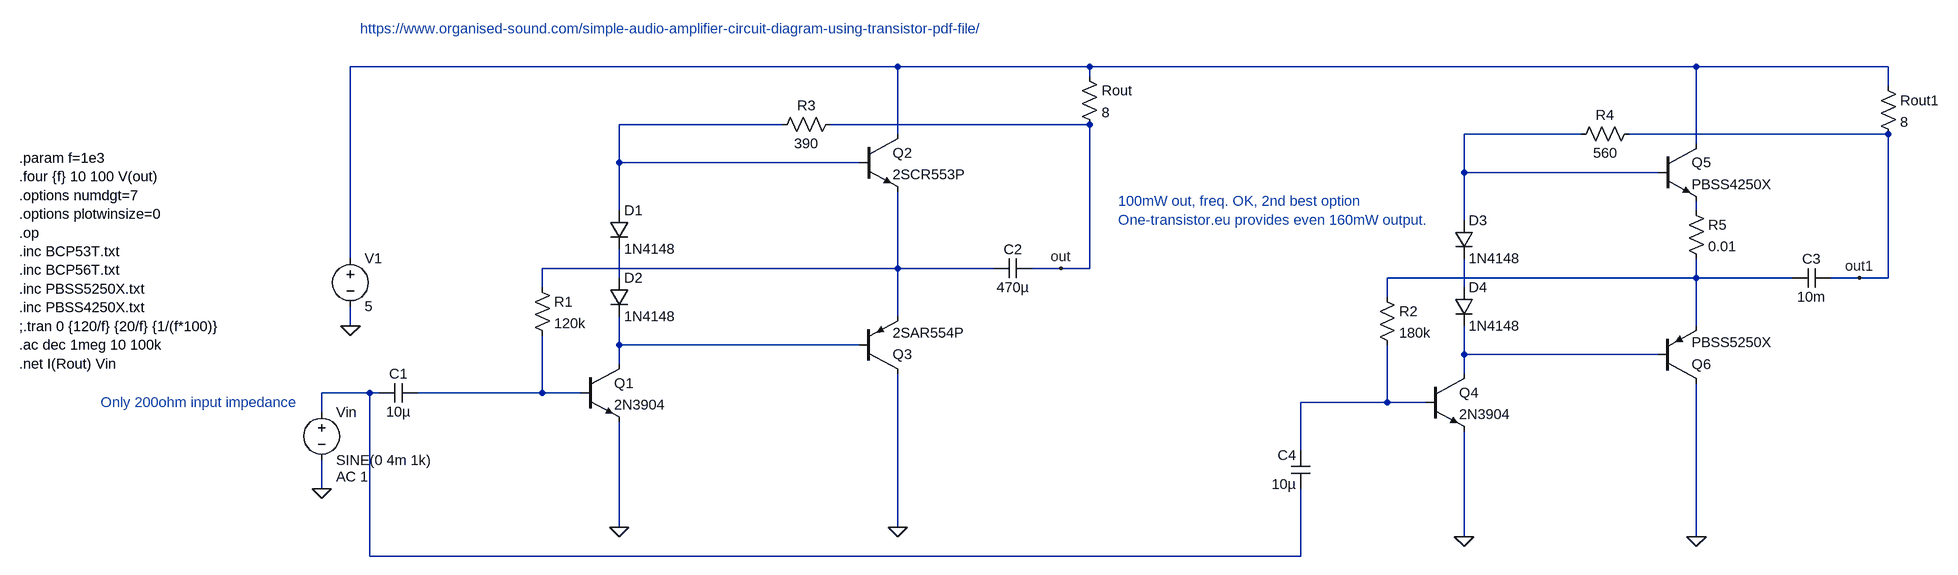
[diagram p0: schematic organ_sound.asc]
organ_sound.asc, the LTspice schematic file:
Version 4
SHEET 1 2668 680
WIRE 848 -256 -64 -256
WIRE 1168 -256 848 -256
WIRE 2256 -256 1168 -256
WIRE 2576 -256 2256 -256
WIRE 1168 -240 1168 -256
WIRE 2576 -224 2576 -256
WIRE 656 -160 384 -160
WIRE 1168 -160 736 -160
WIRE 848 -144 848 -256
WIRE 2064 -144 1792 -144
WIRE 2576 -144 2144 -144
WIRE 2256 -128 2256 -256
WIRE 384 -96 384 -160
WIRE 784 -96 384 -96
WIRE 1792 -80 1792 -144
WIRE 2192 -80 1792 -80
WIRE 384 -16 384 -96
WIRE 2256 -16 2256 -32
WIRE 1792 0 1792 -80
WIRE -64 64 -64 -256
WIRE 848 80 848 -48
WIRE 848 80 256 80
WIRE 1008 80 848 80
WIRE 1120 80 1072 80
WIRE 1168 80 1168 -160
WIRE 1168 80 1120 80
WIRE 384 96 384 48
WIRE 2256 96 2256 64
WIRE 2256 96 1664 96
WIRE 2416 96 2256 96
WIRE 2528 96 2480 96
WIRE 2576 96 2576 -144
WIRE 2576 96 2528 96
WIRE 256 112 256 80
WIRE 1792 112 1792 64
WIRE 1664 128 1664 96
WIRE 848 160 848 80
WIRE -64 176 -64 144
WIRE 2256 176 2256 96
WIRE 384 208 384 160
WIRE 784 208 384 208
WIRE 1792 224 1792 176
WIRE 2192 224 1792 224
WIRE 384 240 384 208
WIRE 1792 256 1792 224
WIRE -32 288 -112 288
WIRE -16 288 -32 288
WIRE 256 288 256 192
WIRE 256 288 48 288
WIRE 320 288 256 288
WIRE 1664 304 1664 208
WIRE 1664 304 1520 304
WIRE 1728 304 1664 304
WIRE -112 320 -112 288
WIRE 1520 384 1520 304
WIRE -112 448 -112 400
WIRE 384 512 384 336
WIRE 848 512 848 256
WIRE 1792 528 1792 352
WIRE 2256 528 2256 272
WIRE -32 560 -32 288
WIRE 1520 560 1520 448
WIRE 1520 560 -32 560
FLAG -64 176 0
FLAG -112 448 0
FLAG 384 512 0
FLAG 848 512 0
FLAG 1120 80 out
FLAG 1792 528 0
FLAG 2256 528 0
FLAG 2528 96 out1
DATAFLAG 928 80 ""
DATAFLAG 608 -96 ""
DATAFLAG 592 208 ""
DATAFLAG 144 288 ""
DATAFLAG 2336 96 ""
DATAFLAG 2016 -80 ""
DATAFLAG 2000 224 ""
DATAFLAG 1552 304 ""
SYMBOL voltage -64 48 R0
SYMATTR InstName V1
SYMATTR Value 5
SYMBOL res 240 96 R0
SYMATTR InstName R1
SYMATTR Value 120k
SYMBOL npn 320 240 R0
SYMATTR InstName Q1
SYMATTR Value 2N3904
SYMBOL npn 784 -144 R0
SYMATTR InstName Q2
SYMATTR Value 2SCR553P
SYMBOL pnp 784 256 M180
SYMATTR InstName Q3
SYMATTR Value 2SAR554P
SYMBOL res 752 -176 R90
WINDOW 0 0 56 VBottom 2
WINDOW 3 32 56 VTop 2
SYMATTR InstName R3
SYMATTR Value 390
SYMBOL res 1152 -256 R0
SYMATTR InstName Rout
SYMATTR Value 8
SYMBOL voltage -112 304 R0
WINDOW 123 24 124 Left 2
WINDOW 39 0 0 Left 0
SYMATTR Value2 AC 1
SYMATTR InstName Vin
SYMATTR Value SINE(0 4m 1k)
SYMBOL cap 48 272 R90
WINDOW 0 0 32 VBottom 2
WINDOW 3 32 32 VTop 2
SYMATTR InstName C1
SYMATTR Value 10µ
SYMBOL cap 1072 64 R90
WINDOW 0 0 32 VBottom 2
WINDOW 3 32 32 VTop 2
SYMATTR InstName C2
SYMATTR Value 470µ
SYMBOL diode 368 -16 R0
SYMATTR InstName D1
SYMATTR Value 1N4148
SYMBOL diode 368 96 R0
SYMATTR InstName D2
SYMATTR Value 1N4148
SYMBOL res 1648 112 R0
SYMATTR InstName R2
SYMATTR Value 180k
SYMBOL npn 1728 256 R0
SYMATTR InstName Q4
SYMATTR Value 2N3904
SYMBOL npn 2192 -128 R0
SYMATTR InstName Q5
SYMATTR Value PBSS4250X
SYMATTR Prefix X
SYMBOL pnp 2192 272 M180
SYMATTR InstName Q6
SYMATTR Value PBSS5250X
SYMATTR Prefix X
SYMBOL res 2160 -160 R90
WINDOW 0 0 56 VBottom 2
WINDOW 3 32 56 VTop 2
SYMATTR InstName R4
SYMATTR Value 560
SYMBOL res 2560 -240 R0
SYMATTR InstName Rout1
SYMATTR Value 8
SYMBOL cap 2480 80 R90
WINDOW 0 0 32 VBottom 2
WINDOW 3 32 32 VTop 2
SYMATTR InstName C3
SYMATTR Value 10m
SYMBOL diode 1776 0 R0
SYMATTR InstName D3
SYMATTR Value 1N4148
SYMBOL diode 1776 112 R0
SYMATTR InstName D4
SYMATTR Value 1N4148
SYMBOL cap 1536 448 R180
WINDOW 0 24 56 Left 2
WINDOW 3 24 8 Left 2
SYMATTR InstName C4
SYMATTR Value 10µ
SYMBOL res 2240 -32 R0
SYMATTR InstName R5
SYMATTR Value 0.01
TEXT -616 -104 Left 2 !.param f=1e3\n.four {f} 10 100 V(out)\n.options numdgt=7\n.options plotwinsize=0\n.op\n.inc BCP53T.txt\n.inc BCP56T.txt\n.inc PBSS5250X.txt\n.inc PBSS4250X.txt\n;.tran 0 {120/f} {20/f} {1/(f*100)}\n.ac dec 1meg 10 100k\n.net I(Rout) Vin
TEXT -48 -320 Left 2 ;https://www.organised-sound.com/simple-audio-amplifier-circuit-diagram-using-transistor-pdf-file/
TEXT 1216 -32 Left 2 ;100mW out, freq. OK, 2nd best option\nOne-transistor.eu provides even 160mW output.
TEXT -480 304 Left 2 ;Only 200ohm input impedance

The netlist it stands for:
* organ_sound.asc
V1 N001 0 5
R1 N005 N012 120k
Q1 N009 N012 0 0 2N3904
Q2 N001 N002 N005 0 2SCR553P
Q3 0 N009 N005 0 2SAR554P
R3 out N002 390
Rout N001 out 8
Vin N011 0 SINE(0 4m 1k) AC 1
C1 N012 N011 10µ
C2 out N005 470µ
D1 N002 N006 1N4148
D2 N006 N009 1N4148
R2 N007 N013 180k
Q4 N010 N013 0 0 2N3904
XQ5 N001 N003 N004 PBSS4250X  ; pins C B E
XQ6 0 N010 N007 PBSS5250X  ; pins C B E
R4 out1 N003 560
Rout1 N001 out1 8
C3 out1 N007 10m
D3 N003 N008 1N4148
D4 N008 N010 1N4148
C4 N011 N013 10µ
R5 N004 N007 0.01
.model D D
.lib standard.dio
.model NPN NPN
.model PNP PNP
.lib standard.bjt
.param f=1e3
.four {f} 10 100 V(out)
.options numdgt=7
.options plotwinsize=0
.op
.inc BCP53T.txt
.inc BCP56T.txt
.inc PBSS5250X.txt
.inc PBSS4250X.txt
;.tran 0 {120/f} {20/f} {1/(f*100)}
.ac dec 1meg 10 100k
.net I(Rout) Vin
* https://www.organised-sound.com/simple-audio-amplifier-circuit-diagram-using-transistor-pdf-file/
* 100mW out, freq. OK, 2nd best option
* One-transistor.eu provides even 160mW output.
* Only 200ohm input impedance
.backanno
.end